# Altium schematic sheet MCU_Block.SchDoc
size A4; SheetNumber: 4; SheetTotal: 5
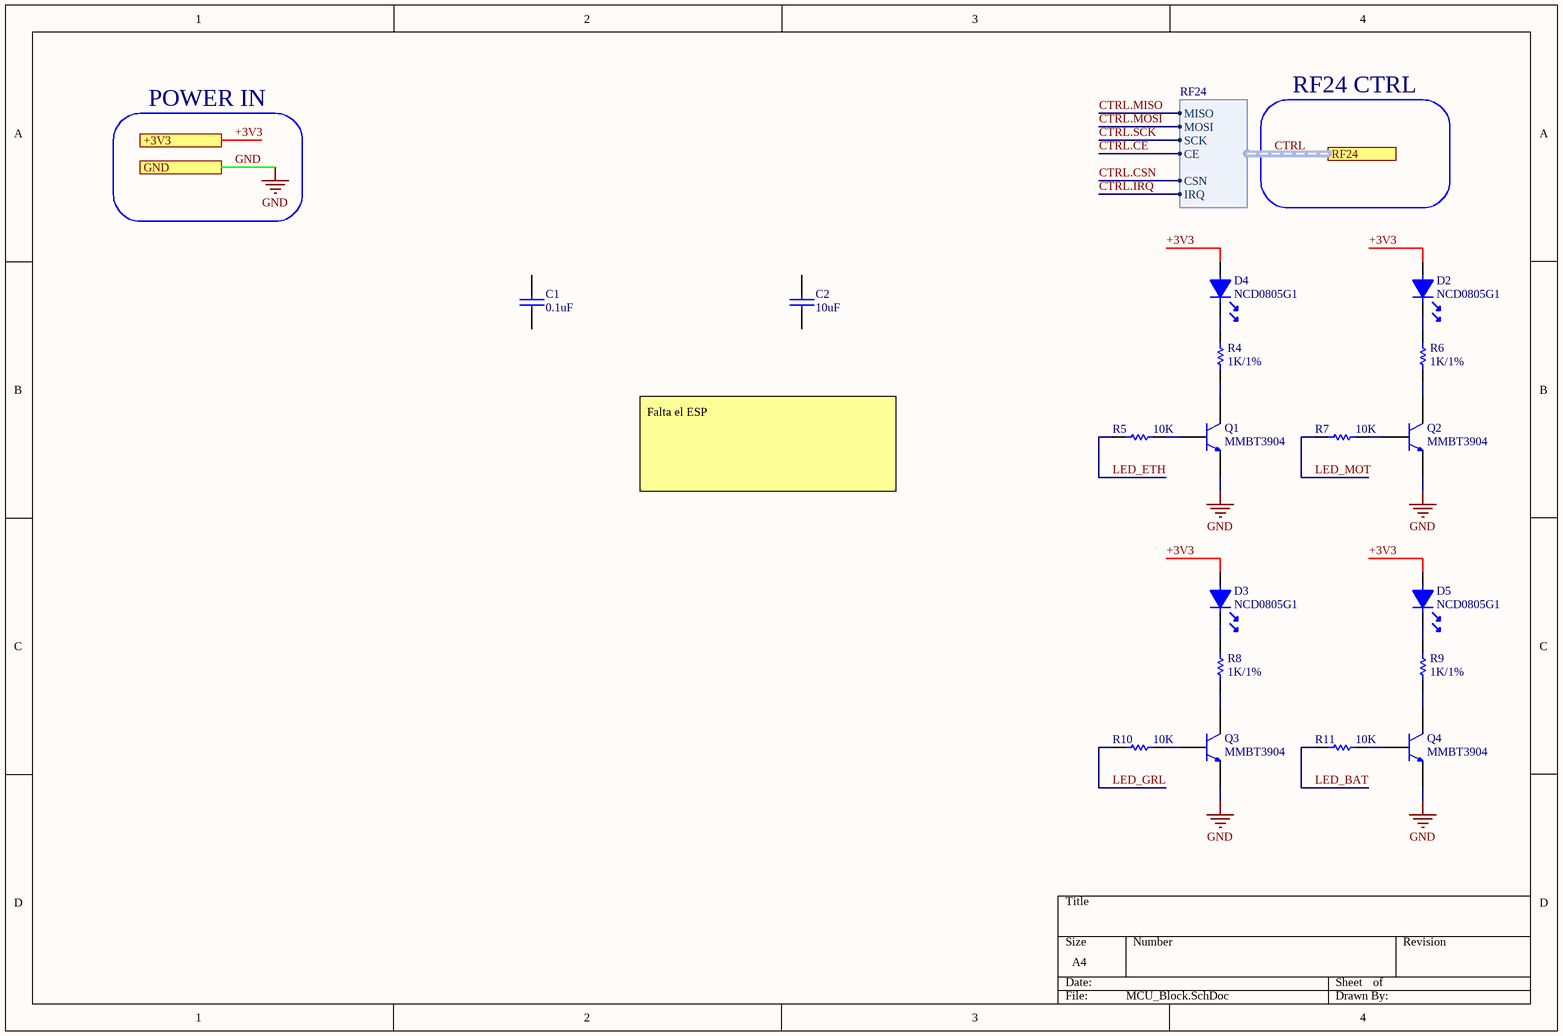
[diagram p0: MCU_Block.SchDoc]

## Parts
C1  0.1uF  [0402-CAP-TDK]
C2  10uF  [0603-CAP-TDK]
D2  NCD0805G1  [LED-0805]
D3  NCD0805G1  [LED-0805]
D4  NCD0805G1  [LED-0805]
D5  NCD0805G1  [LED-0805]
Q1  MMBT3904  [VS-SOT-23]
Q2  MMBT3904  [VS-SOT-23]
Q3  MMBT3904  [VS-SOT-23]
Q4  MMBT3904  [VS-SOT-23]
R4  1K/1%  [0402-RES-PANASONIC]
R5  10K  [0402-RES-PANASONIC]
R6  1K/1%  [0402-RES-PANASONIC]
R7  10K  [0402-RES-PANASONIC]
R8  1K/1%  [0402-RES-PANASONIC]
R9  1K/1%  [0402-RES-PANASONIC]
R10  10K  [0402-RES-PANASONIC]
R11  10K  [0402-RES-PANASONIC]

## Ports
+3V3, GND, RF24 (harness RF24)

## Harnesses
RF24: CE, CSN, IRQ, MISO, MOSI, SCK

## Nets
GND: Q1.2(E) Q2.2(E) Q3.2(E) Q4.2(E) ; port GND
+3V3: D2.1 D3.1 D4.1 D5.1 ; port +3V3
CTRL.CE: port RF24.CE
CTRL.CSN: port RF24.CSN
CTRL.IRQ: port RF24.IRQ
CTRL.MISO: port RF24.MISO
CTRL.MOSI: port RF24.MOSI
CTRL.SCK: port RF24.SCK
LED_BAT: R11.2
LED_ETH: R5.2
LED_GRL: R10.2
LED_MOT: R7.2
NetD2_2: D2.2 R6.2
NetD3_2: D3.2 R8.2
NetD4_2: D4.2 R4.2
NetD5_2: D5.2 R9.2
NetQ1_1: Q1.1(B) R5.1
NetQ1_3: Q1.3(C) R4.1
NetQ2_1: Q2.1(B) R7.1
NetQ2_3: Q2.3(C) R6.1
NetQ3_1: Q3.1(B) R10.1
NetQ3_3: Q3.3(C) R8.1
NetQ4_1: Q4.1(B) R11.1
NetQ4_3: Q4.3(C) R9.1

Not connected (* = marked no-connect by the designer): C1 1 2; C2 1 2

## Buses and harness runs
harness CTRL = port RF24

## Notes on the sheet
- POWER IN
- RF24 CTRL
- Falta el ESP

## Library data of the parts
C1 C2 = CAP-SMD
  C1: JLCPart: C307331
  C2: JLCPart: C96446
D2-D5 = NCD0805G1: Green 65mW 0805 Light Emitting Diodes (LED); JLCPart: C84260
Q1-Q4 = MMBT3904: Bipolar (BJT) Transistor NPN 40 V 200 mA 300MHz 350 mW Surface Mount SOT-23; Digikey_PN: 5272-MMBT3904CT-ND; JLCPart: C20526
R4-R11 = RES-SMD
  R4 R6 R8 R9: JLCPart: C11702
  R5 R7 R10 R11: JLCPart: C25744